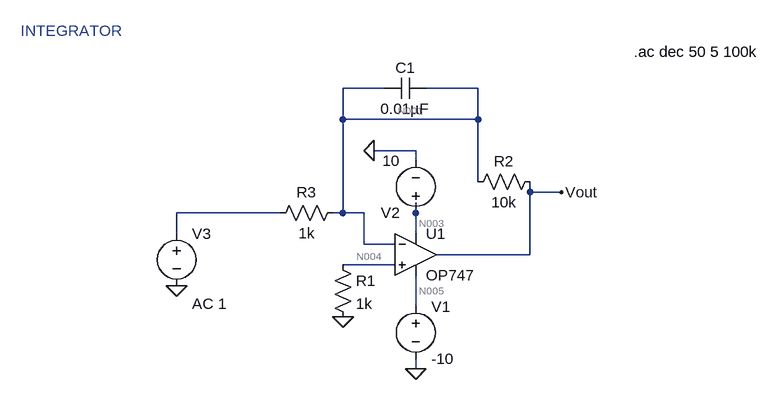
[diagram p0: schematic integrator_op.asc]
integrator_op.asc, the LTspice schematic file:
Version 4.1
SHEET 1 880 680
WIRE 16 -208 -48 -208
WIRE 160 -208 80 -208
WIRE -48 -160 -48 -208
WIRE 160 -160 160 -208
WIRE 160 -160 -48 -160
WIRE 64 -112 0 -112
WIRE 64 -96 64 -112
WIRE 160 -64 160 -160
WIRE 240 -48 240 -64
WIRE 288 -48 240 -48
WIRE -144 -16 -304 -16
WIRE -48 -16 -48 -160
WIRE -48 -16 -64 -16
WIRE -16 -16 -48 -16
WIRE 64 -16 64 -32
WIRE -304 16 -304 -16
WIRE 64 16 64 -16
WIRE -16 32 -16 -16
WIRE 32 32 -16 32
WIRE 240 48 240 -48
WIRE 240 48 96 48
WIRE 32 64 -48 64
WIRE 64 128 64 80
WIRE 64 224 64 208
FLAG 64 224 0
FLAG -48 144 0
FLAG -304 96 0
FLAG 0 -112 0
FLAG 288 -48 Vout
SYMBOL OpAmps\\OP747 64 -16 R0
SYMATTR InstName U1
SYMBOL res -64 48 R0
SYMATTR InstName R1
SYMATTR Value 1k
SYMBOL res 256 -80 R90
WINDOW 0 0 56 VBottom 2
WINDOW 3 32 56 VTop 2
SYMATTR InstName R2
SYMATTR Value 10k
SYMBOL res -48 -32 R90
WINDOW 0 0 56 VBottom 2
WINDOW 3 32 56 VTop 2
SYMATTR InstName R3
SYMATTR Value 1k
SYMBOL voltage 64 112 R0
WINDOW 123 0 0 Left 0
WINDOW 39 0 0 Left 0
SYMATTR InstName V1
SYMATTR Value -10
SYMBOL voltage 64 0 R180
WINDOW 123 0 0 Left 0
WINDOW 39 0 0 Left 0
SYMATTR InstName V2
SYMATTR Value 10
SYMBOL voltage -304 0 R0
WINDOW 123 24 124 Left 2
WINDOW 39 0 0 Left 0
SYMATTR InstName V3
SYMATTR Value ""
SYMATTR Value2 AC 1
SYMBOL cap 80 -224 R90
WINDOW 0 0 32 VBottom 2
WINDOW 3 32 32 VTop 2
SYMATTR InstName C1
SYMATTR Value 0.01µF
TEXT -544 -296 Left 2 ;INTEGRATOR
TEXT 400 -264 Left 2 !.ac dec 50 5 100k

The netlist it stands for:
* integrator_op.asc
X§U1 N004 N001 N003 N005 Vout OP747  ; pins In+ In- V+ V- OUT
R1 N004 0 1k
R2 Vout N001 10k
R3 N001 N002 1k
V1 N005 0 -10
V2 N003 0 10
V3 N002 0 AC 1
C1 N001 N001 0.01µF
* INTEGRATOR
.ac dec 50 5 100k
.backanno
.end

* Results of the author's LTspice run, read from the files saved beside the schematic
* Operating Point, zero values left out:
*   V(n001) = 91.21 µV
*   V(n005) = -10 V
*   V(vout) = 911.2 µV
*   V(n004) = 11.21 µV
*   V(n003) = 10 V
*   I(R3) = 91.21 nA
*   I(R1) = 11.21 nA
*   I(V3) = 91.21 nA
*   I(R2) = 82 nA
*   I(V1) = 268.5 µA
*   I(V2) = -268.6 µA
*   Ix(u1:1) = -11.21 nA
*   Ix(u1:2) = -9.214 nA
*   Ix(u1:99) = 268.6 µA
*   Ix(u1:50) = -268.5 µA
*   Ix(u1:45) = -82 nA
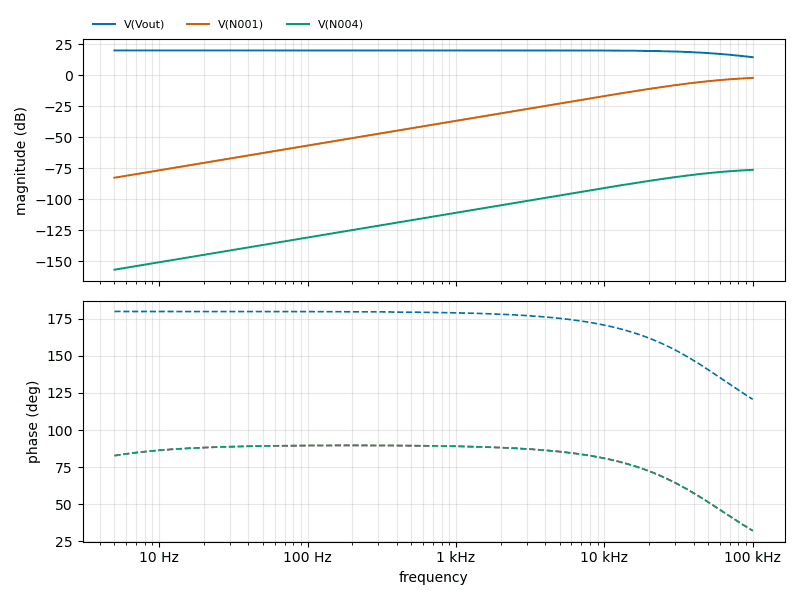
[diagram p1: AC Analysis of integrator_op.asc, plotted from the saved traces]
* AC Analysis, 1 run:
*   V(Vout): 20.00 dB at 5 Hz, 14.50 dB at 100 kHz, peak 20.00 dB at 5 Hz, 3 dB below the peak at 62.6 kHz
*   V(N001): -82.58 dB at 5 Hz, -2.14 dB at 100 kHz, peak -2.14 dB at 100 kHz, 3 dB below the peak at 46.88 kHz
*   V(N004): -156.67 dB at 5 Hz, -76.22 dB at 100 kHz, peak -76.22 dB at 100 kHz, 3 dB below the peak at 46.88 kHz